# Altium schematic sheet FPGA.SCHDOC
size B
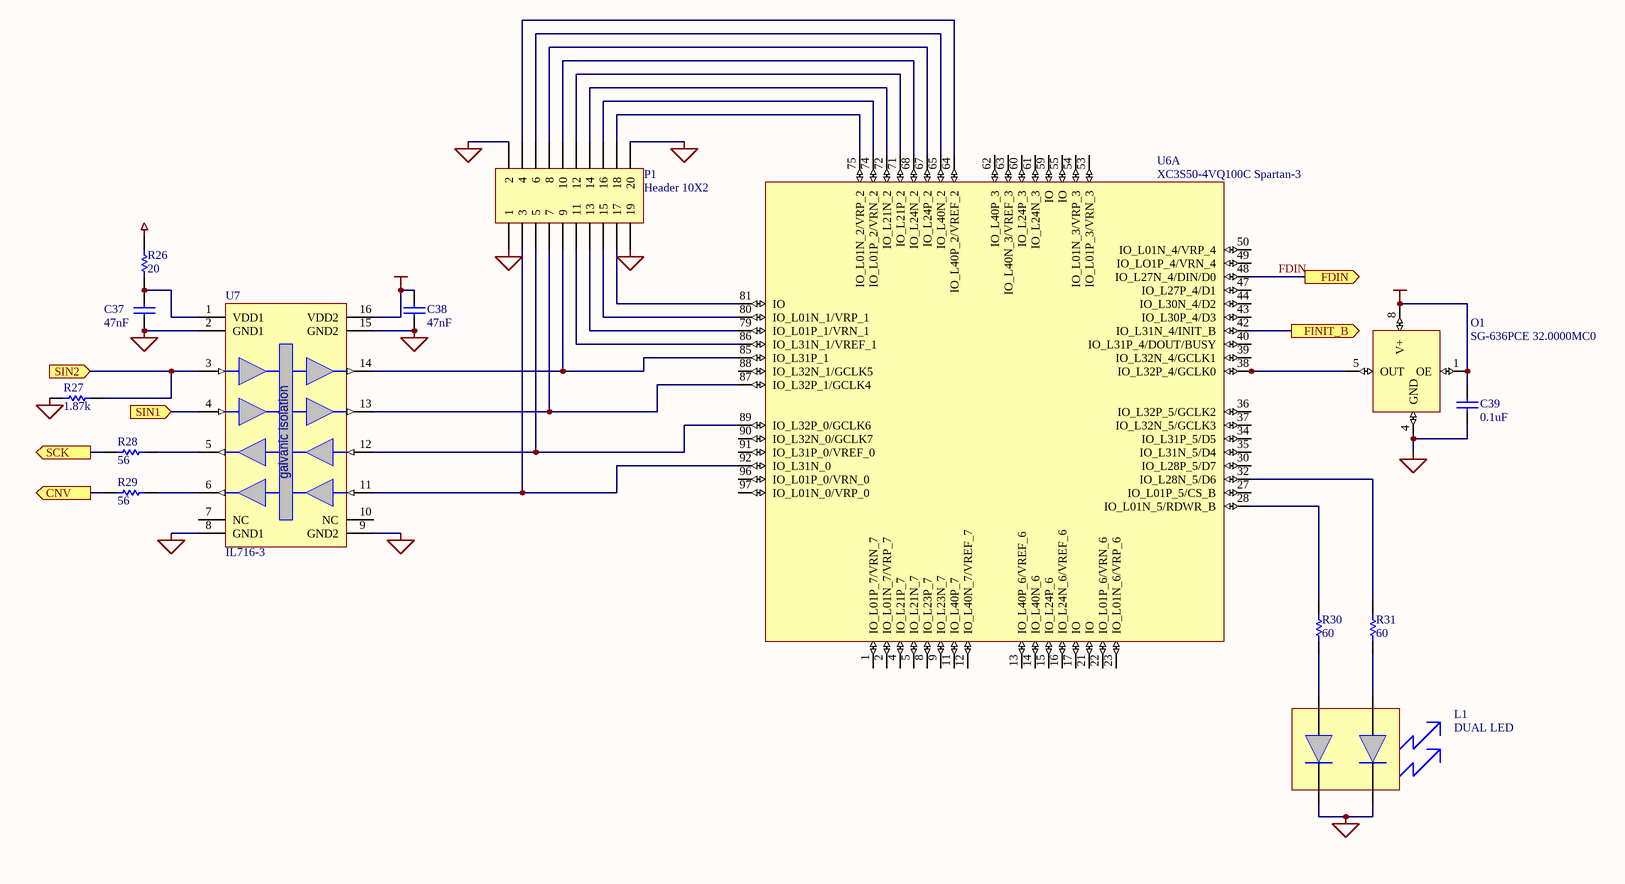
[diagram p0: FPGA.SCHDOC]

## Parts
C37  value 47nF  [CC1608-0603]  (hidden comment: Cap)
C38  value 47nF  [CC1608-0603]  (hidden comment: Cap)
C39  value 0.1uF  [CC1608-0603]  (hidden comment: Cap)
L1  DUAL LED  [LUMEX DUAL RT-ANG LED]
O1  SG-636PCE 32.0000MC0  [SG636PCE]
P1  Header 10X2  [HDR2X10]
R26  value 20  [CC1608-0603]  (hidden comment: Res1)
R27  value 1.87k  [CC1608-0603]  (hidden comment: Res1)
R28  value 56  [CC1608-0603]  (hidden comment: Res1)
R29  value 56  [CC1608-0603]  (hidden comment: Res1)
R30  value 60  [CC1608-0603]  (hidden comment: Res1)
R31  value 60  [CC1608-0603]  (hidden comment: Res1)
U6  XC3S50-4VQ100C Spartan-3  [Xilinx TQ100]  (part A of 2)
U7  IL716-3  [SO-G16/D10]

## Ports
CNV (out), FDIN (out), FINIT_B (out), SCK (out), SIN1 (in), SIN2 (in)

## Nets
AGND: C37.1 R27.1 U7.2(GND1) U7.8(GND1)
AVDD: R26.2
GND: C38.1 C39.2 L1.2 L1.4(C2) O1.4(GND) P1.1 P1.2 P1.19 P1.20 U7.9(GND2) U7.15(GND2)
VCC: C38.2 C39.1 O1.1(OE) O1.8(V+) U7.16(VDD2)
CNV: R29.1 ; port CNV
FDIN: U6.48(IO_L27N_4/DIN/D0) ; port FDIN
FINIT_B: U6.42(IO_L31N_4/INIT_B) ; port FINIT_B
SCK: R28.1 ; port SCK
SIN1: U7.4(IN2) ; port SIN1
SIN2: R27.2 U7.3(IN1) ; port SIN2
NetC37_2: C37.2 R26.1 U7.1(VDD1)
NetL1_1: L1.1(A1) R30.2
NetL1_3: L1.3(A2) R31.2
NetO1_5: O1.5(OUT) U6.38(IO_L32P_4/GCLK0)
NetP1_3: P1.3 U6.92(IO_L31N_0) U7.11(IN4)
NetP1_4: P1.4 U6.64(IO_L40P_2/VREF_2)
NetP1_5: P1.5 U6.89(IO_L32P_0/GCLK6) U7.12(IN3)
NetP1_6: P1.6 U6.65(IO_L40N_2)
NetP1_7: P1.7 U6.87(IO_L32P_1/GCLK4) U7.13(OUT2)
NetP1_8: P1.8 U6.67(IO_L24P_2)
NetP1_9: P1.9 U6.85(IO_L31P_1) U7.14(OUT1)
NetP1_10: P1.10 U6.68(IO_L24N_2)
NetP1_11: P1.11 U6.86(IO_L31N_1/VREF_1)
NetP1_12: P1.12 U6.71(IO_L21P_2)
NetP1_13: P1.13 U6.79(IO_L01P_1/VRN_1)
NetP1_14: P1.14 U6.72(IO_L21N_2)
NetP1_15: P1.15 U6.80(IO_L01N_1/VRP_1)
NetP1_16: P1.16 U6.74(IO_L01P_2/VRN_2)
NetP1_17: P1.17 U6.81(IO)
NetP1_18: P1.18 U6.75(IO_L01N_2/VRP_2)
NetR28_2: R28.2 U7.5(OUT3)
NetR29_2: R29.2 U7.6(OUT4)
NetR30_1: R30.1 U6.28(IO_L01N_5/RDWR_B)
NetR31_1: R31.1 U6.32(IO_L28N_5/D6)

Not connected (* = marked no-connect by the designer): U6 1(IO_L01P_7/VRN_7) 2(IO_L01N_7/VRP_7) 4(IO_L21P_7) 5(IO_L21N_7) 8(IO_L23P_7) 9(IO_L23N_7) 11(IO_L40P_7) 12(IO_L40N_7/VREF_7) 13(IO_L40P_6/VREF_6) 14(IO_L40N_6) 15(IO_L24P_6) 16(IO_L24N_6/VREF_6) 17(IO) 21(IO) 22(IO_L01P_6/VRN_6) 23(IO_L01N_6/VRP_6) 27(IO_L01P_5/CS_B) 30(IO_L28P_5/D7) 34(IO_L31P_5/D5) 35(IO_L31N_5/D4) 36(IO_L32P_5/GCLK2) 37(IO_L32N_5/GCLK3) 39(IO_L32N_4/GCLK1) 40(IO_L31P_4/DOUT/BUSY) 43(IO_L30P_4/D3) 44(IO_L30N_4/D2) 47(IO_L27P_4/D1) 49(IO_LO1P_4/VRN_4) 50(IO_L01N_4/VRP_4) 53(IO_L01P_3/VRN_3) 54(IO_L01N_3/VRP_3) 55(IO) 59(IO) 60(IO_L24P_3) 61(IO_L24N_3) 62(IO_L40P_3) 63(IO_L40N_3/VREF_3) 88(IO_L32N_1/GCLK5) 90(IO_L32N_0/GCLK7) 91(IO_L31P_0/VREF_0) 96(IO_L01P_0/VRN_0) 97(IO_L01N_0/VRP_0); U7 7(NC) 10(NC)

## Notes on the sheet
- (in symbol IL716-3) galvanic isolation

## Library data of the parts
C37-C39 = Cap: Capacitor; Manufacturer: Generic Components; Class I: Passive; Published: 8-Jun-2000; Revision: July-2002: Re-released for DXP Platform.; Publisher: Altium Limited; Class II: Capacitor
O1 = SG-636PCE: Epson CMOS/TTL Oscillator; Vendor: Epson Electronics America Inc
P1 = Header 10X2: Header, 10-Pin, Dual row; LatestRevisionDate: 17-Jul-2002; LatestRevisionNote: Re-released for DXP Platform.; Publisher: Altium Limited
R26-R31 = Res1: Resistor; Manufacturer: Generic Components; Class I: Passive; Published: 8-Jun-2000; Revision: July-2002: Re-released for DXP Platform.; Publisher: Altium Limited; Class II: Resistor
U6 = XC3S50-4VQ100C: Xilinx Spartan-3 VQ100; Vendor: Xilinx
U7 = IL716-3: High speed digital coupler; Vendor: NVE Corp/Isolation Products